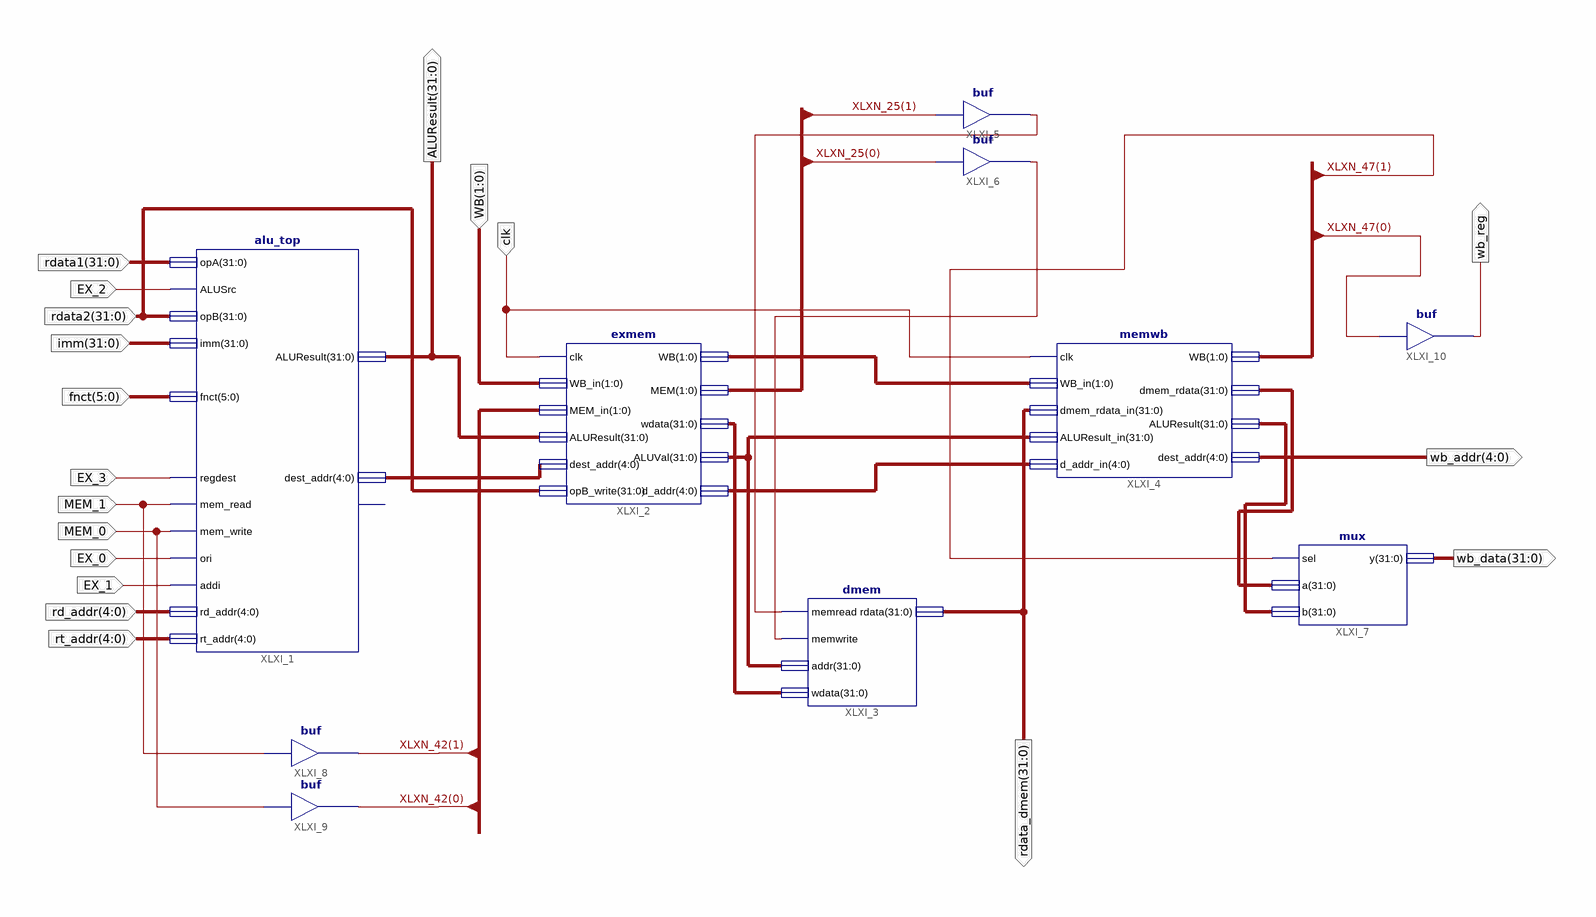
[diagram p0: schematic sheet 1]
// Xilinx ISE schematic alu_exmem_dmem_memwb_wb.sch (spartan3a) as structural Verilog: 10 symbols, 19 ports
module alu_exmem_dmem_memwb_wb (
  input  [31:0] rdata1,
  input  EX_2,
  input  [31:0] rdata2,
  input  [31:0] imm,
  input  [5:0] fnct,
  input  EX_3,
  input  MEM_1,
  input  MEM_0,
  input  EX_0,
  input  EX_1,
  input  [4:0] rd_addr,
  input  [4:0] rt_addr,
  input  clk,
  input  [1:0] WB,
  output [31:0] ALUResult,
  output [31:0] rdata_dmem,
  output [4:0] wb_addr,
  output [31:0] wb_data,
  output wb_reg
);

  wire XLXN_28, XLXN_29;
  wire [1:0] XLXN_14, XLXN_25, XLXN_42, XLXN_47;
  wire [4:0] XLXN_19, XLXN_24;
  wire [31:0] XLXN_17, XLXN_30, XLXN_38, XLXN_39;

  alu_top XLXI_1 (
    .opA(rdata1), .ALUSrc(EX_2), .opB(rdata2), .imm(imm), .fnct(fnct), .regdest(EX_3), .mem_read(MEM_1),
    .mem_write(MEM_0), .ori(EX_0), .addi(EX_1), .rd_addr(rd_addr), .rt_addr(rt_addr), .ALUResult(ALUResult),
    .dest_addr(XLXN_24));  // open: carry_sign
  exmem XLXI_2 (
    .clk(clk), .WB_in(WB), .MEM_in(XLXN_42), .ALUResult(ALUResult), .dest_addr(XLXN_24), .opB_write(rdata2),
    .WB(XLXN_14), .MEM(XLXN_25), .wdata(XLXN_30), .ALUVal(XLXN_17), .d_addr(XLXN_19));
  dmem XLXI_3 (.memread(XLXN_28), .memwrite(XLXN_29), .addr(XLXN_17), .wdata(XLXN_30), .rdata(rdata_dmem));
  memwb XLXI_4 (
    .clk(clk), .WB_in(XLXN_14), .dmem_rdata_in(rdata_dmem), .ALUResult_in(XLXN_17), .d_addr_in(XLXN_19),
    .WB(XLXN_47), .dmem_rdata(XLXN_38), .ALUResult(XLXN_39), .dest_addr(wb_addr));
  buf XLXI_5 (XLXN_28, XLXN_25[1]);
  buf XLXI_6 (XLXN_29, XLXN_25[0]);
  mux XLXI_7 (.sel(XLXN_47[1]), .a(XLXN_38), .b(XLXN_39), .y(wb_data));
  buf XLXI_8 (XLXN_42[1], MEM_1);
  buf XLXI_9 (XLXN_42[0], MEM_0);
  buf XLXI_10 (wb_reg, XLXN_47[0]);
endmodule
